# Altium schematic sheet [04] - A3.SchDoc
size A3; DocumentNumber: 4; SheetNumber: 4; SheetTotal: 6
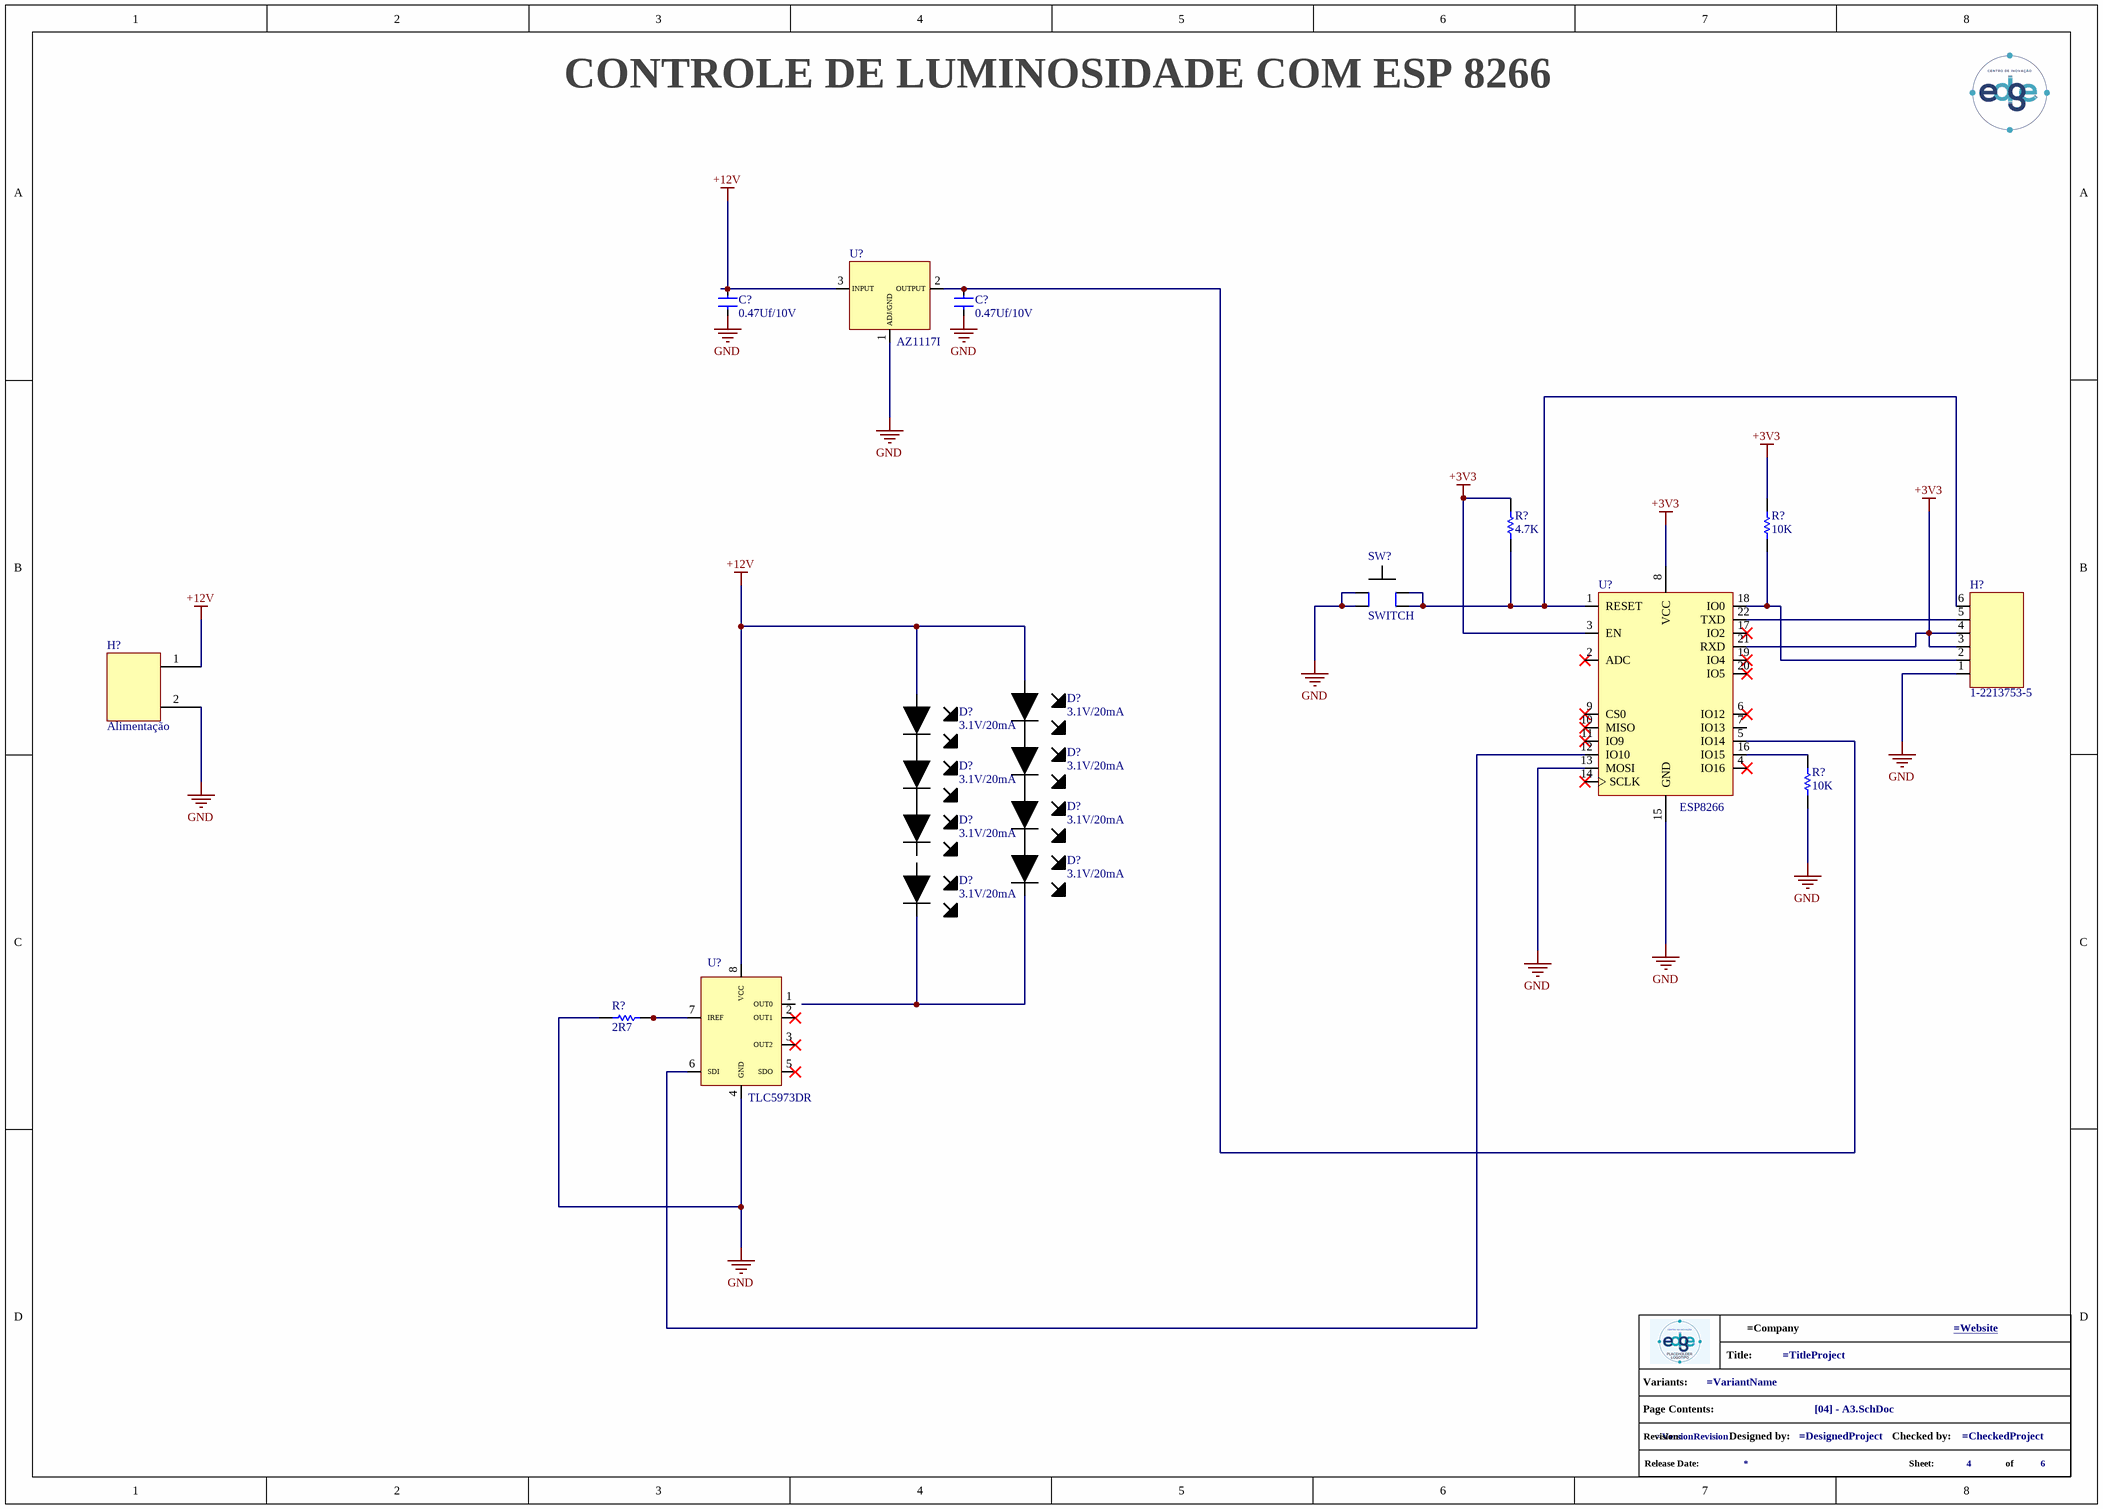
[diagram p0: [04] - A3.SchDoc]

## Parts
(Parts that share a designator on the sheet are numbered #1, #2 ... from top to bottom, then left to right.)
*?  info_project  (value not drawn)  (graphical)
C?#1  0.47Uf/10V  [C0402]
C?#2  0.47Uf/10V  [C0402]
D?#1  3.1V/20mA  [WHITE_LED]
D?#2  3.1V/20mA  [WHITE_LED]
D?#3  3.1V/20mA  [WHITE_LED]
D?#4  3.1V/20mA  [WHITE_LED]
D?#5  3.1V/20mA  [WHITE_LED]
D?#6  3.1V/20mA  [WHITE_LED]
D?#7  3.1V/20mA  [WHITE_LED]
D?#8  3.1V/20mA  [WHITE_LED]
H?#1  1-2213753-5
H?#2  Alimentação
R?#1  4.7K  [R0402]
R?#2  10K  [C0603]
R?#3  10K  [C0603]
R?#4  2R7  [R0805]
SW?  SWITCH
U?#1  AZ1117I  [SOT230P700X170-4N]
U?#2  ESP8266  [XCVR_ESP8266-12E/ESP-12E]
U?#3  TLC5973DR  [TLC5973]

## Nets
+3V3: H?#1.3 H?#1.4 R?#1.2 R?#2.2 U?#2.3(EN) U?#2.8(VCC) U?#2.21(RXD)
+12V: C?#1.1 D?#1.1 D?#2.1 H?#2.1 U?#1.3(INPUT) U?#3.8(VCC)
GND: C?#1.2 C?#2.1 H?#1.1 H?#2.2 R?#3.1 R?#4.1 SW?.SW1 U?#1.1(ADJ/GND) U?#2.13(MOSI) U?#2.15(GND) U?#3.4(GND)
NetC?#2_2: C?#2.2 U?#1.2(OUTPUT) U?#2.5(IO14)
NetD?#1_2: D?#1.2 D?#3.1
NetD?#2_2: D?#2.2 D?#4.1
NetD?#3_2: D?#3.2 D?#5.1
NetD?#4_2: D?#4.2 D?#6.1
NetD?#5_2: D?#5.2 D?#7.1
NetD?#7_2: D?#7.2 D?#8.2
NetH?#1_2: H?#1.2 R?#2.1 U?#2.18(IO0)
NetH?#1_5: H?#1.5 U?#2.22(TXD)
NetH?#1_6: H?#1.6 R?#1.1 SW?.SW1 U?#2.1(RESET)
NetR?#3_2: R?#3.2 U?#2.16(IO15)
NetR?#4_2: R?#4.2 U?#3.7(IREF)
NetU?#2_12: U?#2.12(IO10) U?#3.6(SDI)

Not connected (* = marked no-connect by the designer): D?#6 2; D?#8 1; U?#2 2(ADC)* 4(IO16)* 6(IO12)* 7(IO13) 9(CS0)* 10(MISO)* 11(IO9)* 14(SCLK)* 17(IO2)* 19(IO4)* 20(IO5)*; U?#3 1(OUT0) 2(OUT1)* 3(OUT2)* 5(SDO)*

## Notes on the sheet
- CONTROLE DE LUMINOSIDADE COM ESP 8266
- (in symbol info_project) Title:; Variants:; Page Contents:; Revision:; Designed by:; Checked by:; Release Date:; Sheet:; of

## Library data of the parts
C?#1 C?#2 = CC0402KRX5R6BB474: MLCC- CAP CER 0.47UF 10V X5R 0402; Supplier 1: Digi-Key; Supplier Part Number 1: 1276-1173-1-ND
D?#1-D?#8 = SM0402UWC: LED -  LED WHITE DIFFUSED 0402 SMD; Supplier 1: Digi-Key; Supplier Part Number 1: 492-2209-1-ND; .PCBChecked: *; .SCHChecked: *
H?#1 = 1-2213753-5: CONN-Headers  6 POS HIGH TEMP MATE-N-LOK SKT ASSM; Manufacturer 1: TE Connectivity; Supplier 1: Mouser; Manufacturer Part Number 1: 1-2213753-5; Stock 1: 2922; Pricing 1: 1=1.55000, 10=1.27000, 50=1.27000, 100=1.09000, 1000=0.86200, 10000=0.74800 (USD); RoHS: Yes; RoHS Compliant: Yes; Supplier Part Number 1: 571-1-2213753-5
R?#1 = CFR-25JB-52-4K7 _1: RES 4.7K OHM 1/4W 5% AXIAL; Manufacturer 1: Yageo; Resistance: 4.7kR; Power Rating: 250mW; Temperature Coefficient: 500ppm/°C; Supplier 1: Digi-Key; Manufacturer Part Number 1: CFR-25JB-52-4K7; Stock 1: 122217; Pricing 1: 1=0.10000, 10=0.06700, 25=0.04640, 50=0.03600, 100=0.02580, 250=0.02008, 500=0.01596, 1000=0.01133, 5000=0.00876 (USD); RoHS: Yes; Case/Package: Axial; Min Operating Temperature: -55°C; Max Operating Temperature: 155°C; Tolerance: 5%; Package Quantity: 200; Packaging: Bulk; Resistor Type: Carbon Film; Number of Terminations: 2; Max Power Dissipation: 250mW; Series: Carbon Film; Length: 0.248inch; Lead Free: Lead Free; RoHS Compliant: Yes; ComponentLink1URL: http://www.yageo.com/NewPortal/yageodocoutput?fileName=/pdf/throughhole/Yageo_LR_CFR_2013.pdf&src-supplier=Digi-Key; ComponentLink1Description: http://www.yageo.com/NewPortal/yageodocoutput?fileName=/pdf/throughhole/Yageo_LR_CFR_2013.pdf&src-supplier=Digi-Key; ComponentLink2URL: http://www.yageo.com/documents/recent/General%20Type_CFR.pdf?src-supplier=Future+Electronics; ComponentLink2Description: http://www.yageo.com/documents/recent/General%20Type_CFR.pdf?src-supplier=Future+Electronics; Supplier Part Number 1: 4.7KQBK-ND
R?#2 R?#3 = CFR-25JB-52-10K: RES 10K OHM 1/4W 5% AXIAL; Manufacturer 1: Yageo; Resistance: 10kR; Temperature Coefficient: 500ppm/°C; Max Power Dissipation: 250mW; Supplier 1: Digi-Key; Manufacturer Part Number 1: CFR-25JB-52-10K; Stock 1: 275987; Pricing 1: 1=0.10000, 10=0.06700, 25=0.04640, 50=0.03600, 100=0.02580, 250=0.02008, 500=0.01596, 1000=0.01133, 5000=0.00876 (USD); RoHS: Yes; Case/Package: Axial; Min Operating Temperature: -55°C; Max Operating Temperature: 155°C; Package Quantity: 200; Packaging: Bulk; Tolerance: 5%; Resistor Type: Carbon Film; Number of Terminations: 2; Series: Carbon Film; Length: 0.248inch; RoHS Compliant: Yes; Lead Free: Lead Free; ComponentLink1URL: http://components.arrow.com/part/dataview/0323_07021247?src-supplier=Arrow+Europe; ComponentLink1Description: http://components.arrow.com/part/dataview/0323_07021247?src-supplier=Arrow+Europe; ComponentLink2URL: http://www.yageo.com/NewPortal/yageodocoutput?fileName=/pdf/throughhole/Yageo_LR_CFR_2013.pdf&src-supplier=Digi-Key; ComponentLink2Description: http://www.yageo.com/NewPortal/yageodocoutput?fileName=/pdf/throughhole/Yageo_LR_CFR_2013.pdf&src-supplier=Digi-Key; Supplier Part Number 1: 10KQBK-ND
R?#4 = RMCF0805JT2R70: RES -  2.7 OHM 1/8W 5% 0805; Manufacturer 1: Stackpole Electronics; Resistance: 2.7R; Max Power Dissipation: 125mW; Temperature Coefficient: 200ppm/°C; Supplier 1: Digi-Key; Manufacturer Part Number 1: RMCF0805JT2R70; Stock 1: 439; Pricing 1: 1=0.10000, 10=0.02000, 100=0.00810, 1000=0.00366, 2500=0.00318 (USD); RoHS: Yes; Mount: Surface Mount; Case/Package: 0805; Case Code (Metric): 2012; Case Code (Imperial): 0805; Contact Plating: Tin,Matte; Min Operating Temperature: -55°C; Max Operating Temperature: 155°C; Packaging: Tape and Reel; Tolerance: 5%; Resistor Type: Thick Film; Number of Terminations: 2; Features: Automotive AEC-Q200; Series: RMCF; Length: 0.079inch; Width: 0.049inch; Height: 0.026inch; Radiation Hardening: No; RoHS Compliant: Yes; ComponentLink1URL: http://components.arrow.com/part/dataview/50862679S7247335N1174?src-supplier=Arrow+Electronics; ComponentLink1Description: http://components.arrow.com/part/dataview/50862679S7247335N1174?src-supplier=Arrow+Electronics; ComponentLink2URL: https://www.seielect.com/catalog/sei-rmcf_rmcp.pdf?src-supplier=Digi-Key; ComponentLink2Description: https://www.seielect.com/catalog/sei-rmcf_rmcp.pdf?src-supplier=Digi-Key; ComponentLink3URL: https://www.seielect.com/catalog/SEI-Packaging.pdf?src-supplier=Digi-Key; ComponentLink3Description: https://www.seielect.com/catalog/SEI-Packaging.pdf?src-supplier=Digi-Key; ComponentLink4URL: https://www.seielect.com/catalog/SEI-RMCF_RMCP.pdf?src-supplier=Avnet; ComponentLink4Description: https://www.seielect.com/catalog/SEI-RMCF_RMCP.pdf?src-supplier=Avnet; Supplier Part Number 1: 738-RMCF0805JT2R70CT-ND; .SCHChecked: *
SW? = switch: SWITCH - 4 PINS
U?#1 = AZ1117I: IC - REG LINEAR 3.3V 1A SOT223; Supplier 1: Digi-Key; Supplier Part Number 1: AZ1117IH-3.3TRG1DICT-ND
U?#2 = ESP8266: IC - ESP8266 SMT Module / WiFi 802.11b/g/n Transceiver Module 2.4GHz ~ 2.5GHz Integrated, Trace Surface Mount; Supplier 1: Digi-Key; Supplier Part Number 1: 1528-1438-ND
U?#3 = TLC5973DR: IC - TLC5973DR LED Lighting Drivers 3Ch 12B PWM Constant Crnt LED Dvr; Supplier 1: Mouser; Supplier Part Number 1: 595-TLC5973DR